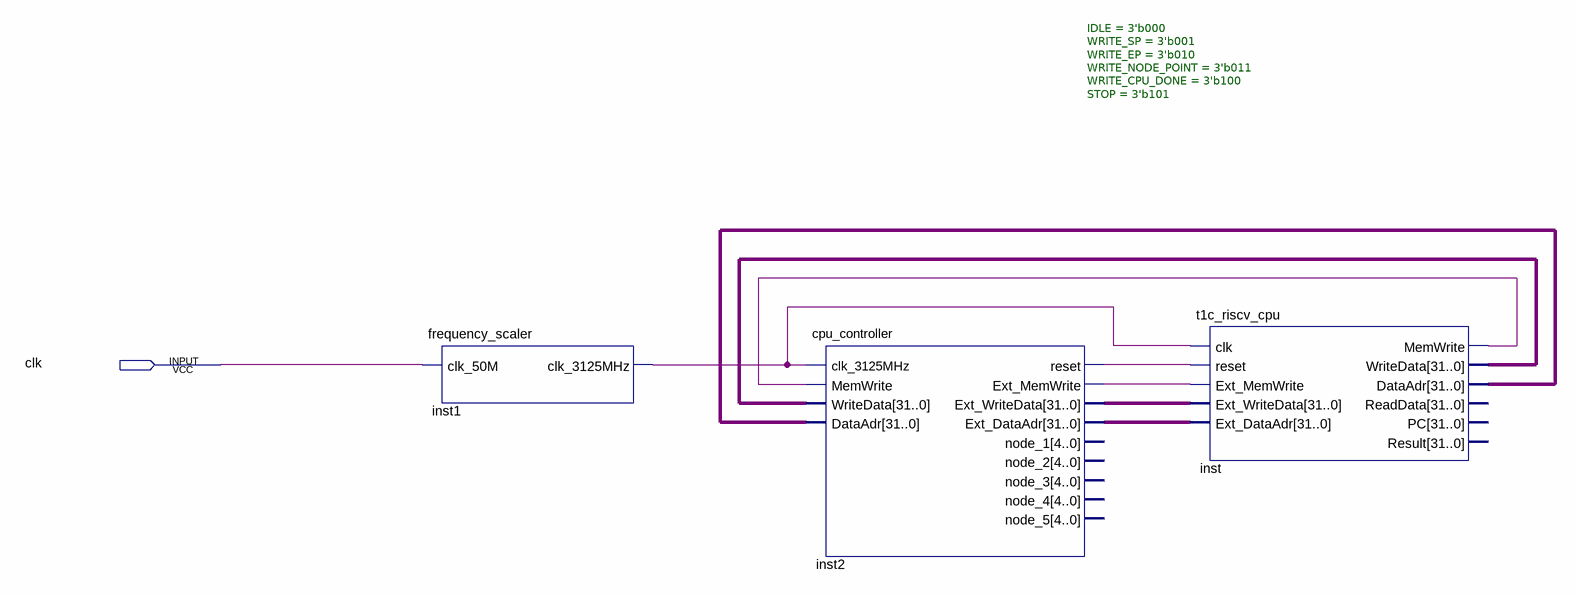
[diagram p0: schematic sheet]
// Quartus schematic task5.bdf as structural Verilog: 3 symbols, 1 pins
module task5 (
  input  clk
);

  wire inst1_clk_3125mhz, inst2_ext_memwrite, inst2_reset, inst_memwrite;
  wire [31:0] inst2_ext_dataadr, inst2_ext_writedata, inst_dataadr, inst_writedata;

  frequency_scaler inst1 (.clk_50M(clk), .clk_3125MHz(inst1_clk_3125mhz));
  cpu_controller #(.IDLE(3'b000), .WRITE_SP(3'b001), .WRITE_EP(3'b010), .WRITE_NODE_POINT(3'b011), .WRITE_CPU_DONE(3'b100), .STOP(3'b101)) inst2 (
    .clk_3125MHz(inst1_clk_3125mhz), .MemWrite(inst_memwrite), .WriteData(inst_writedata),
    .DataAdr(inst_dataadr), .reset(inst2_reset), .Ext_MemWrite(inst2_ext_memwrite),
    .Ext_WriteData(inst2_ext_writedata), .Ext_DataAdr(inst2_ext_dataadr));  // open: node_1, node_2, node_3, node_4, node_5
  t1c_riscv_cpu inst (
    .clk(inst1_clk_3125mhz), .reset(inst2_reset), .Ext_MemWrite(inst2_ext_memwrite),
    .Ext_WriteData(inst2_ext_writedata), .Ext_DataAdr(inst2_ext_dataadr), .MemWrite(inst_memwrite),
    .WriteData(inst_writedata), .DataAdr(inst_dataadr));  // open: ReadData, PC, Result
endmodule
